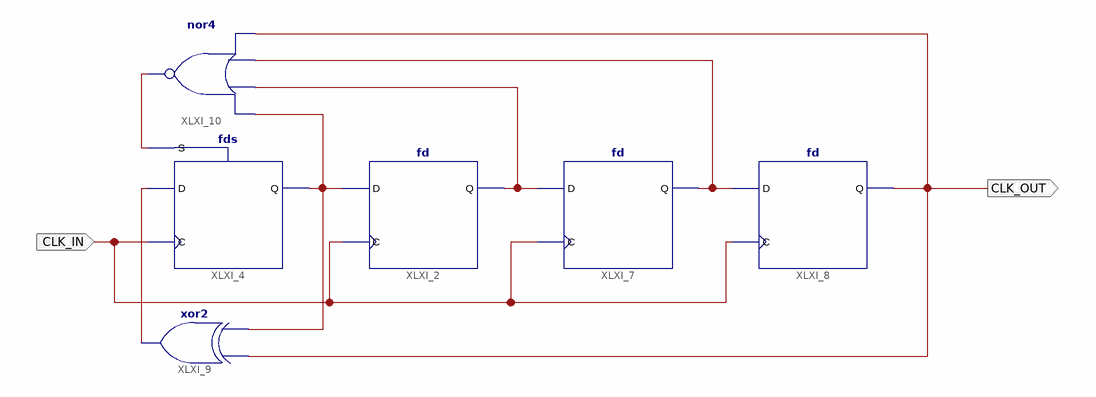
[diagram p0: schematic sheet 1]
// Xilinx ISE schematic LFSR4Bit.sch (spartan6) as structural Verilog: 6 symbols, 2 ports
module LFSR4Bit (
  input  CLK_IN,
  output CLK_OUT
);

  wire XLXN_2, XLXN_3, XLXN_7, XLXN_10, XLXN_12;

  fds XLXI_4 (.C(CLK_IN), .D(XLXN_7), .S(XLXN_12), .Q(XLXN_10));
  fd XLXI_2 (.C(CLK_IN), .D(XLXN_10), .Q(XLXN_2));
  fd XLXI_7 (.C(CLK_IN), .D(XLXN_2), .Q(XLXN_3));
  fd XLXI_8 (.C(CLK_IN), .D(XLXN_3), .Q(CLK_OUT));
  xor XLXI_9 (XLXN_7, XLXN_10, CLK_OUT);
  nor XLXI_10 (XLXN_12, CLK_OUT, XLXN_3, XLXN_2, XLXN_10);
endmodule
